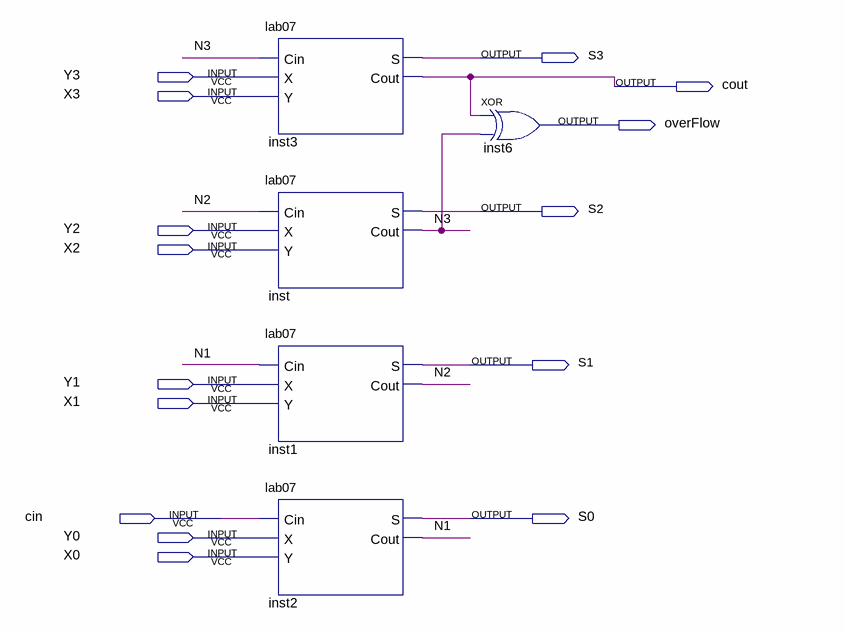
[diagram p0: schematic sheet]
// Quartus schematic adder_4bit.bdf as structural Verilog: 5 symbols, 15 pins
module adder_4bit (
  input  Y3,
  input  X3,
  input  Y2,
  input  X2,
  input  Y1,
  input  X1,
  input  cin,
  input  Y0,
  input  X0,
  output S3,
  output cout,
  output overFlow,
  output S2,
  output S1,
  output S0
);

  wire N1, N2, N3;

  lab07 inst3 (.Cin(N3), .X(Y3), .Y(X3), .S(S3), .Cout(cout));
  lab07 inst (.Cin(N2), .X(Y2), .Y(X2), .S(S2), .Cout(N3));
  lab07 inst1 (.Cin(N1), .X(Y1), .Y(X1), .S(S1), .Cout(N2));
  lab07 inst2 (.Cin(cin), .X(Y0), .Y(X0), .S(S0), .Cout(N1));
  xor inst6 (overFlow, cout, N3);
endmodule
